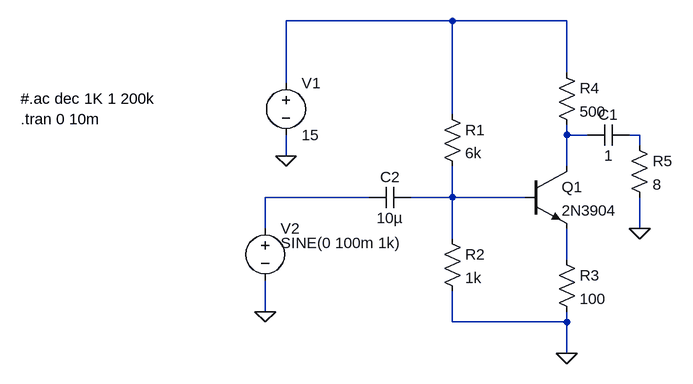
[diagram p0: schematic PA.asc]
PA.asc, the LTspice schematic file:
Version 4
SHEET 1 880 680
WIRE 400 32 144 32
WIRE 576 32 400 32
WIRE 576 112 576 32
WIRE 144 128 144 32
WIRE 400 176 400 32
WIRE 576 208 576 192
WIRE 608 208 576 208
WIRE 688 208 672 208
WIRE 688 224 688 208
WIRE 144 240 144 208
WIRE 576 256 576 208
WIRE 272 304 112 304
WIRE 400 304 400 256
WIRE 400 304 336 304
WIRE 512 304 400 304
WIRE 112 352 112 304
WIRE 688 352 688 304
WIRE 400 368 400 304
WIRE 576 400 576 352
WIRE 112 480 112 432
WIRE 400 496 400 448
WIRE 576 496 576 480
WIRE 576 496 400 496
WIRE 576 544 576 496
FLAG 576 544 0
FLAG 144 240 0
FLAG 112 480 0
FLAG 688 352 0
SYMBOL Res 384 160 R0
SYMATTR InstName R1
SYMATTR Value 6k
SYMBOL Res 384 352 R0
SYMATTR InstName R2
SYMATTR Value 1k
SYMBOL npn 512 256 R0
SYMATTR InstName Q1
SYMATTR Value 2N3904
SYMBOL Voltage 144 112 R0
SYMATTR InstName V1
SYMATTR Value 15
SYMBOL Cap 336 288 R90
WINDOW 0 0 32 VBottom 2
WINDOW 3 32 32 VTop 2
SYMATTR InstName C2
SYMATTR Value 10µ
SYMBOL Voltage 112 336 R0
WINDOW 3 24 38 Left 2
SYMATTR InstName V2
SYMATTR Value SINE(0 100m 1k)
SYMATTR Value2 AC 100m
SYMBOL Res 560 96 R0
SYMATTR InstName R4
SYMATTR Value 500
SYMBOL Res 560 384 R0
SYMATTR InstName R3
SYMATTR Value 100
SYMBOL Res 672 208 R0
SYMATTR InstName R5
SYMATTR Value 8
SYMBOL Cap 672 192 R90
WINDOW 0 0 32 VBottom 2
WINDOW 3 32 32 VTop 2
SYMATTR InstName C1
SYMATTR Value 1
TEXT -264 152 Left 2 !#.ac dec 1K 1 200k\n.tran 0 10m

The netlist it stands for:
* PA.asc
R1 N001 N005 6k
R2 N005 0 1k
Q1 N002 N005 N006 0 2N3904
V1 N001 0 15
C2 N005 N004 10µ
V2 N004 0 SINE(0 100m 1k) AC 100m
R4 N001 N002 500
R3 N006 0 100
R5 N003 0 8
C1 N003 N002 1
.model NPN NPN
.model PNP PNP
.lib standard.bjt
#.ac dec 1K 1 200k
.tran 0 10m
.backanno
.end